# EAGLE schematic anti-spark-pcb (EAGLE 7.6.0)
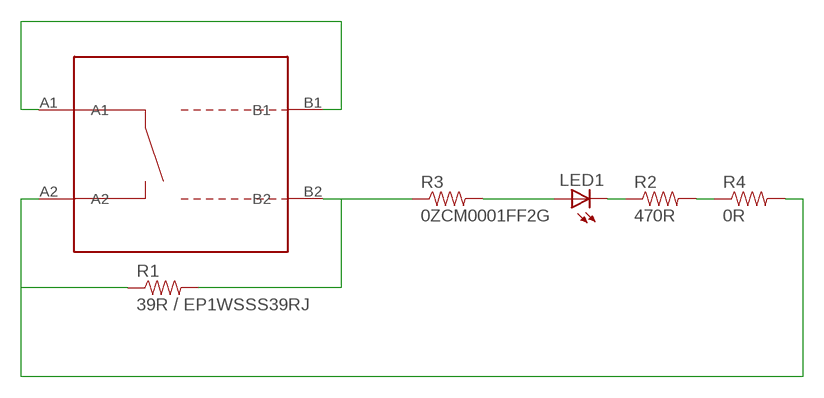
[diagram p0: schematic, sheet 1]

## Parts
LED1  LED1206  [LED-1206]
PCB1  KAKE-SWITCH-PCB  [KAKE-SWITCH-PCB]
R1  39R / EP1WSSS39RJ  RESISTORPTH-1W  [AXIAL-0.6]
R2  470R  RESISTOR0603-RES  [0603-RES]
R3  0ZCM0001FF2G  RESISTOR0603-RES  [0603-RES]
R4  0R  RESISTOR0603-RES  [0603-RES]

## Nets
N$1: PCB1.B2 R1.P$2 R3.1
N$2: PCB1.A2 R1.P$1 R4.2
N$3: PCB1.A1 PCB1.B1
N$5: LED1.A R3.2
N$6: R2.2 R4.1
N$7: LED1.C R2.1

## Library data of the parts
LED1 = anti-spark-pcb:LED: LEDs Standard schematic elements and footprints for 5mm, 3mm, 1206, and 0603 sized LEDs. 5mm - Spark Fun Electronics SKU : COM-00529 (and others)
PCB1 = anti-spark-pcb:KAKE-SWITCH-PCB
R1-R4 = anti-spark-pcb:RESISTOR: Resistor Basic schematic elements and footprints for 0603, 1206, and PTH resistors.